# EAGLE design PLAdapter (EAGLE 7.6.0)
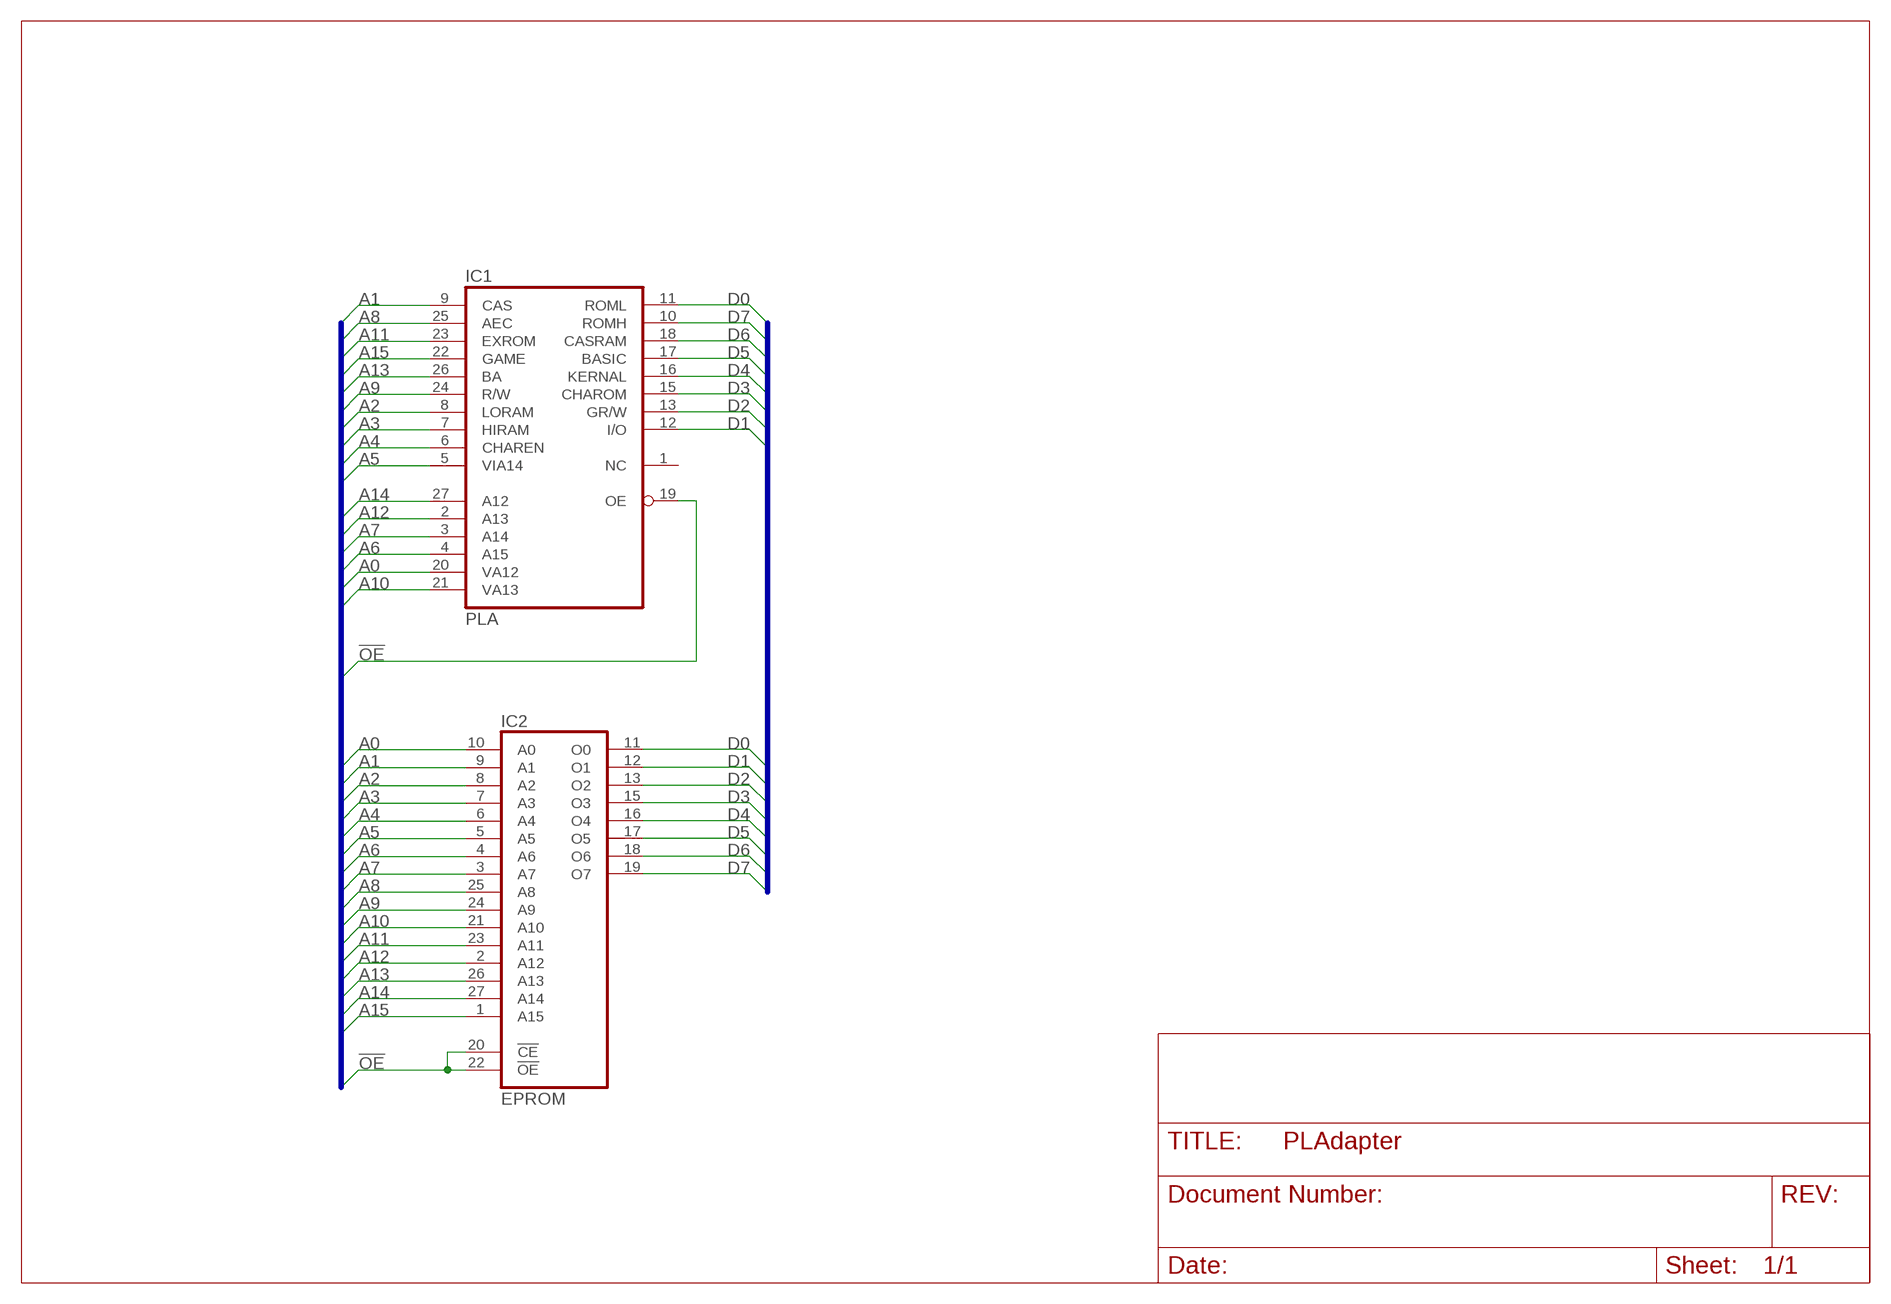
[diagram p0: schematic, sheet 1]

## Parts
IC1  PLA  PLA_C64R  [DIL28-ROUNDPAD]
IC2  EPROM  27512-NR  [DIL28-ROUNDPAD]

## Nets
!OE: IC1.19(OE) IC2.20(!CE) IC2.22(!OE)
A0: IC1.20(VA12) IC2.10(A0)
A1: IC1.9(CAS) IC2.9(A1)
A2: IC1.8(LORAM) IC2.8(A2)
A3: IC1.7(HIRAM) IC2.7(A3)
A4: IC1.6(CHAREN) IC2.6(A4)
A5: IC1.5(VIA14) IC2.5(A5)
A6: IC1.4(A15) IC2.4(A6)
A7: IC1.3(A14) IC2.3(A7)
A8: IC1.25(AEC) IC2.25(A8)
A9: IC1.24(R/W) IC2.24(A9)
A10: IC1.21(VA13) IC2.21(A10)
A11: IC1.23(EXROM) IC2.23(A11)
A12: IC1.2(A13) IC2.2(A12)
A13: IC1.26(BA) IC2.26(A13)
A14: IC1.27(A12) IC2.27(A14)
A15: IC1.22(GAME) IC2.1(A15)
D0: IC1.11(ROML) IC2.11(O0)
D1: IC1.12(I/O) IC2.12(O1)
D2: IC1.13(GR/W) IC2.13(O2)
D3: IC1.15(CHAROM) IC2.15(O3)
D4: IC1.16(KERNAL) IC2.16(O4)
D5: IC1.17(BASIC) IC2.17(O5)
D6: IC1.18(CASRAM) IC2.18(O6)
D7: IC1.10(ROMH) IC2.19(O7)
Unconnected: IC1.1(NC)

## Buses
A[0..18],!WE,!OE,!CE
D[0..7]

## Power pins joined to a net without a drawn wire
GND: IC1.14(GND) IC2.14(GND)
VCC: IC1.28(VCC) IC2.28(VCC)

## Library data of the parts
IC1 = commodore:PLA_C64: Programmable Logic Array This PLA controls which parts of memory are visible to your C64. This lib is created by Ruud Baltissen.
IC2 = 0RB_Memory:27512

## Board
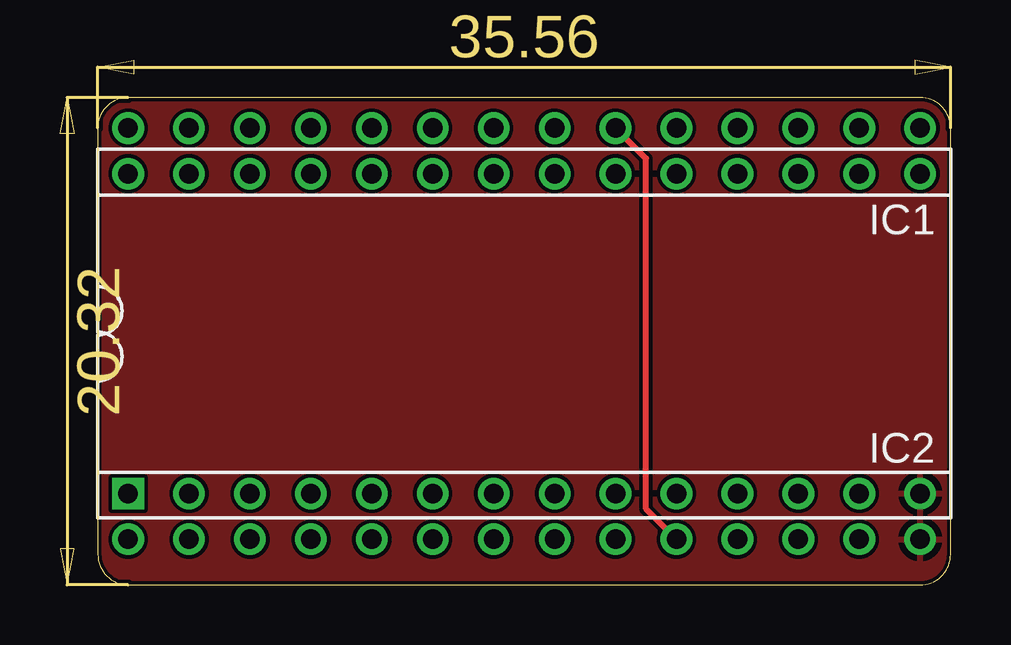
[diagram p1: board, top side]
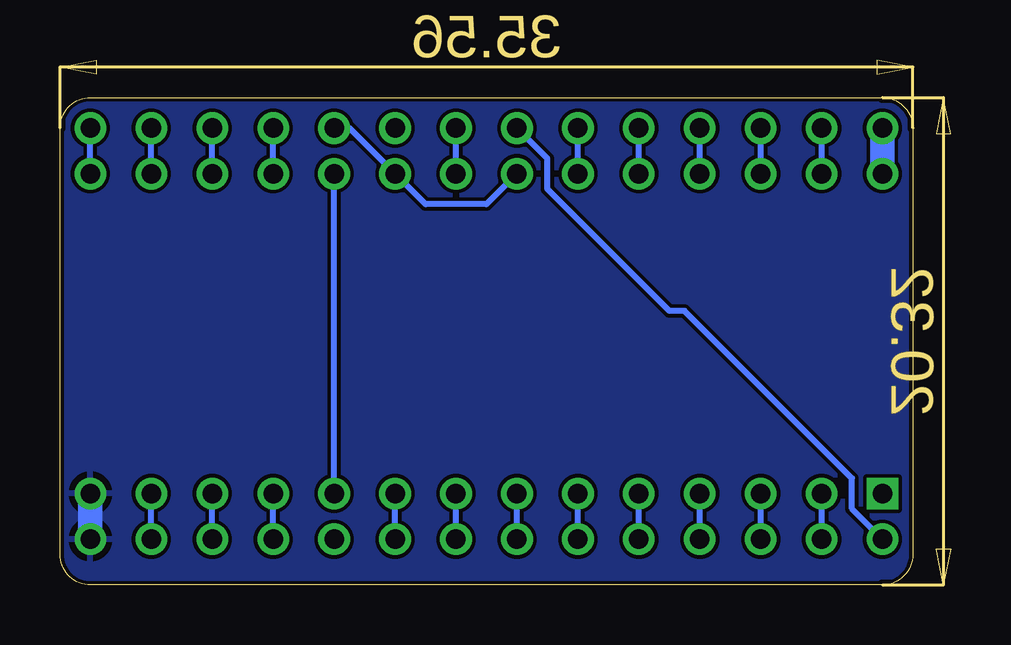
[diagram p2: board, bottom side, seen from below]

Size 35.56 x 20.32 mm. Coordinates in mm from the lower left corner, seen from the top.
Outline: 0,19.05 0.01,1.27 arc90 1.28,0 34.29,0 arc90 35.56,1.27 35.56,19.05 arc90 34.29,20.32 1.27,20.32 arc90 0,19.05
Copper layers (1*16): Top 0.035mm / dielectric 1.5mm / Bottom 0.035mm
Design rules "hackvana": minimum track width 6mil, minimum drill 0.3mm, track to track 6mil, track to pad 6mil, pad to pad 6mil, via to via 6mil, smd to smd 0mil, copper to edge 6mil, drill to drill 6mil, minimum pad ring 10mil, minimum via ring 6mil, stop-mask expansion 2mil, vias tented up to drill 100mil, thermal gap 10mil

### Footprints (pad centres in the part's own frame; a part is rotated, then mirrored left to right if it is on the bottom)
DIL28-ROUNDPAD = drill 0.813 square: 1 -16.51,-7.62 | drill 0.813: 2 -13.97,-7.62; 3 -11.43,-7.62; 4 -8.89,-7.62; 5 -6.35,-7.62; 6 -3.81,-7.62; 7 -1.27,-7.62; 8 1.27,-7.62; 9 3.81,-7.62; 10 6.35,-7.62; 11 8.89,-7.62; 12 11.43,-7.62; 13 13.97,-7.62; 14 16.51,-7.62; 15 16.51,7.62; 16 13.97,7.62; 17 11.43,7.62; 18 8.89,7.62; 19 6.35,7.62; 20 3.81,7.62; 21 1.27,7.62; 22 -1.27,7.62; 23 -3.81,7.62; 24 -6.35,7.62; 25 -8.89,7.62; 26 -11.43,7.62; 27 -13.97,7.62; 28 -16.51,7.62
DIL28-ROUNDPAD' = drill 0.813: 1 -16.51,-7.62; 2 -13.97,-7.62; 3 -11.43,-7.62; 4 -8.89,-7.62; 5 -6.35,-7.62; 6 -3.81,-7.62; 7 -1.27,-7.62; 8 1.27,-7.62; 9 3.81,-7.62; 10 6.35,-7.62; 11 8.89,-7.62; 12 11.43,-7.62; 13 13.97,-7.62; 14 16.51,-7.62; 15 16.51,7.62; 16 13.97,7.62; 17 11.43,7.62; 18 8.89,7.62; 19 6.35,7.62; 20 3.81,7.62; 21 1.27,7.62; 22 -1.27,7.62; 23 -3.81,7.62; 24 -6.35,7.62; 25 -8.89,7.62; 26 -11.43,7.62; 27 -13.97,7.62; 28 -16.51,7.62

### Placement (x,y rotation side)
IC1  17.78,11.43 0 top
IC2  EPROM  [DIL28-ROUNDPAD']  17.78,9.53 0 top

### Tracks (layer width: path | path; a pad name or v marks a point on that pad's centre or on a via)
!OE
  Bottom 0.254: IC2.22 17.78,15.88 20.32,15.88 IC2.20 23.49,19.05 IC1.19
A0
  Top 0.254: IC1.20 22.86,17.78 22.86,3.17 IC2.10
A1
  Bottom 0.254: IC2.9 IC1.9
A2
  Bottom 0.254: IC2.8 IC1.8
A3
  Bottom 0.254: IC2.7 IC1.7
A4
  Bottom 0.254: IC2.6 IC1.6
A5
  Bottom 0.254: IC2.5 IC1.5
A6
  Bottom 0.254: IC2.4 IC1.4
A7
  Bottom 0.254: IC2.3 IC1.3
A8
  Bottom 0.254: IC2.25 IC1.25
A9
  Bottom 0.254: IC2.24 IC1.24
A10
  Bottom 0.254: IC2.21 IC1.21
A11
  Bottom 0.254: IC2.23 IC1.23
A12
  Bottom 0.254: IC2.2 IC1.2
A13
  Bottom 0.254: IC2.26 IC1.26
A14
  Bottom 0.254: IC2.27 IC1.27
A15
  Bottom 0.254: IC2.1 2.54,3.17 2.54,4.45 9.52,11.43 10.16,11.43 15.24,16.51 15.24,17.78 IC1.22
D0
  Bottom 0.254: IC2.11 IC1.11
D1
  Bottom 0.254: IC2.12 IC1.12
D2
  Bottom 0.254: IC2.13 IC1.13
D3
  Bottom 0.254: IC2.15 IC1.15
D4
  Bottom 0.254: IC2.16 IC1.16
D5
  Bottom 0.254: IC2.17 IC1.17
D6
  Bottom 0.254: IC2.18 IC1.18
D7
  Bottom 0.254: IC1.10 IC2.19
GND
  Bottom 1.016: IC2.14 IC1.14
  pour Top: 34.29,0 1.27,0 arc-90 0,1.27 0,19.05 arc-90 1.27,20.32 34.29,20.32 arc-90 35.56,19.05 35.56,1.27 arc-90
  pour Bottom: 34.29,0 1.27,0 arc-90 0,1.27 0,19.05 arc-90 1.27,20.32 34.29,20.32 arc-90 35.56,19.05 35.56,1.27 arc-90
VCC
  Bottom 1.016: IC2.28 IC1.28

### Text on the board
tValues: PLAdapter (c) 2014 RETRO Innovations | go4retro.com